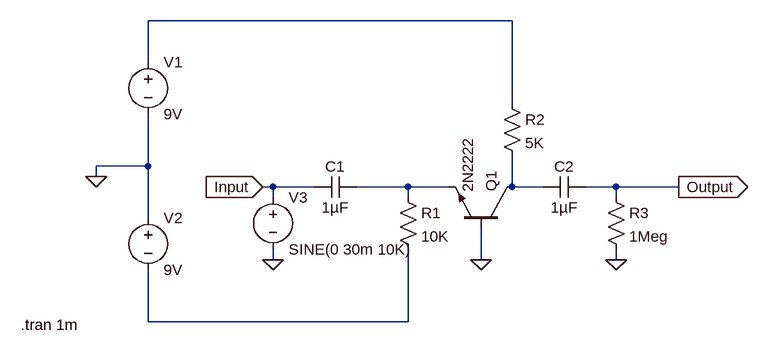
[diagram p0: schematic comgnd.asc]
comgnd.asc, the LTspice schematic file:
Version 4
SHEET 1 880 680
WIRE 272 -112 -288 -112
WIRE -288 -48 -288 -112
WIRE 272 16 272 -112
WIRE -288 112 -288 32
WIRE -288 112 -368 112
WIRE -368 128 -368 112
WIRE -96 144 -112 144
WIRE -32 144 -96 144
WIRE 112 144 32 144
WIRE 176 144 112 144
WIRE 272 144 272 96
WIRE 320 144 272 144
WIRE 432 144 384 144
WIRE 528 144 432 144
WIRE -96 160 -96 144
WIRE 112 160 112 144
WIRE 432 160 432 144
WIRE -288 192 -288 112
WIRE -96 256 -96 240
WIRE 224 256 224 208
WIRE 432 256 432 240
WIRE -288 352 -288 272
WIRE 112 352 112 240
WIRE 112 352 -288 352
FLAG 224 256 0
FLAG -112 144 Input
IOPIN -112 144 In
FLAG 528 144 Output
IOPIN 528 144 Out
FLAG 432 256 0
FLAG -96 256 0
FLAG -368 128 0
SYMBOL npn 272 208 M270
SYMATTR InstName Q1
SYMATTR Value 2N2222
SYMBOL res 96 144 R0
SYMATTR InstName R1
SYMATTR Value 10K
SYMBOL res 256 0 R0
SYMATTR InstName R2
SYMATTR Value 5K
SYMBOL res 416 144 R0
SYMATTR InstName R3
SYMATTR Value 1Meg
SYMBOL cap 32 128 R90
WINDOW 0 0 32 VBottom 2
WINDOW 3 32 32 VTop 2
SYMATTR InstName C1
SYMATTR Value 1µF
SYMBOL cap 384 128 R90
WINDOW 0 0 32 VBottom 2
WINDOW 3 32 32 VTop 2
SYMATTR InstName C2
SYMATTR Value 1µF
SYMBOL voltage -288 -64 R0
WINDOW 123 0 0 Left 0
WINDOW 39 0 0 Left 0
SYMATTR InstName V1
SYMATTR Value 9V
SYMBOL voltage -288 176 R0
WINDOW 123 0 0 Left 0
WINDOW 39 0 0 Left 0
SYMATTR InstName V2
SYMATTR Value 9V
SYMBOL voltage -96 144 R0
WINDOW 123 0 0 Left 0
WINDOW 39 0 0 Left 0
SYMATTR InstName V3
SYMATTR Value SINE(0 30m 10K)
TEXT -484 356 Left 2 !.tran 1m

The netlist it stands for:
* comgnd.asc
Q1 N003 0 N002 0 2N2222
R1 N002 N004 10K
R2 N001 N003 5K
R3 Output 0 1Meg
C1 N002 Input 1µF
C2 Output N003 1µF
V1 N001 0 9V
V2 0 N004 9V
V3 Input 0 SINE(0 30m 10K)
.model NPN NPN
.model PNP PNP
.lib standard.bjt
.tran 1m
.backanno
.end